# EAGLE design xpower_B (EAGLE 7.7.0)

## Sheet 1 of 2
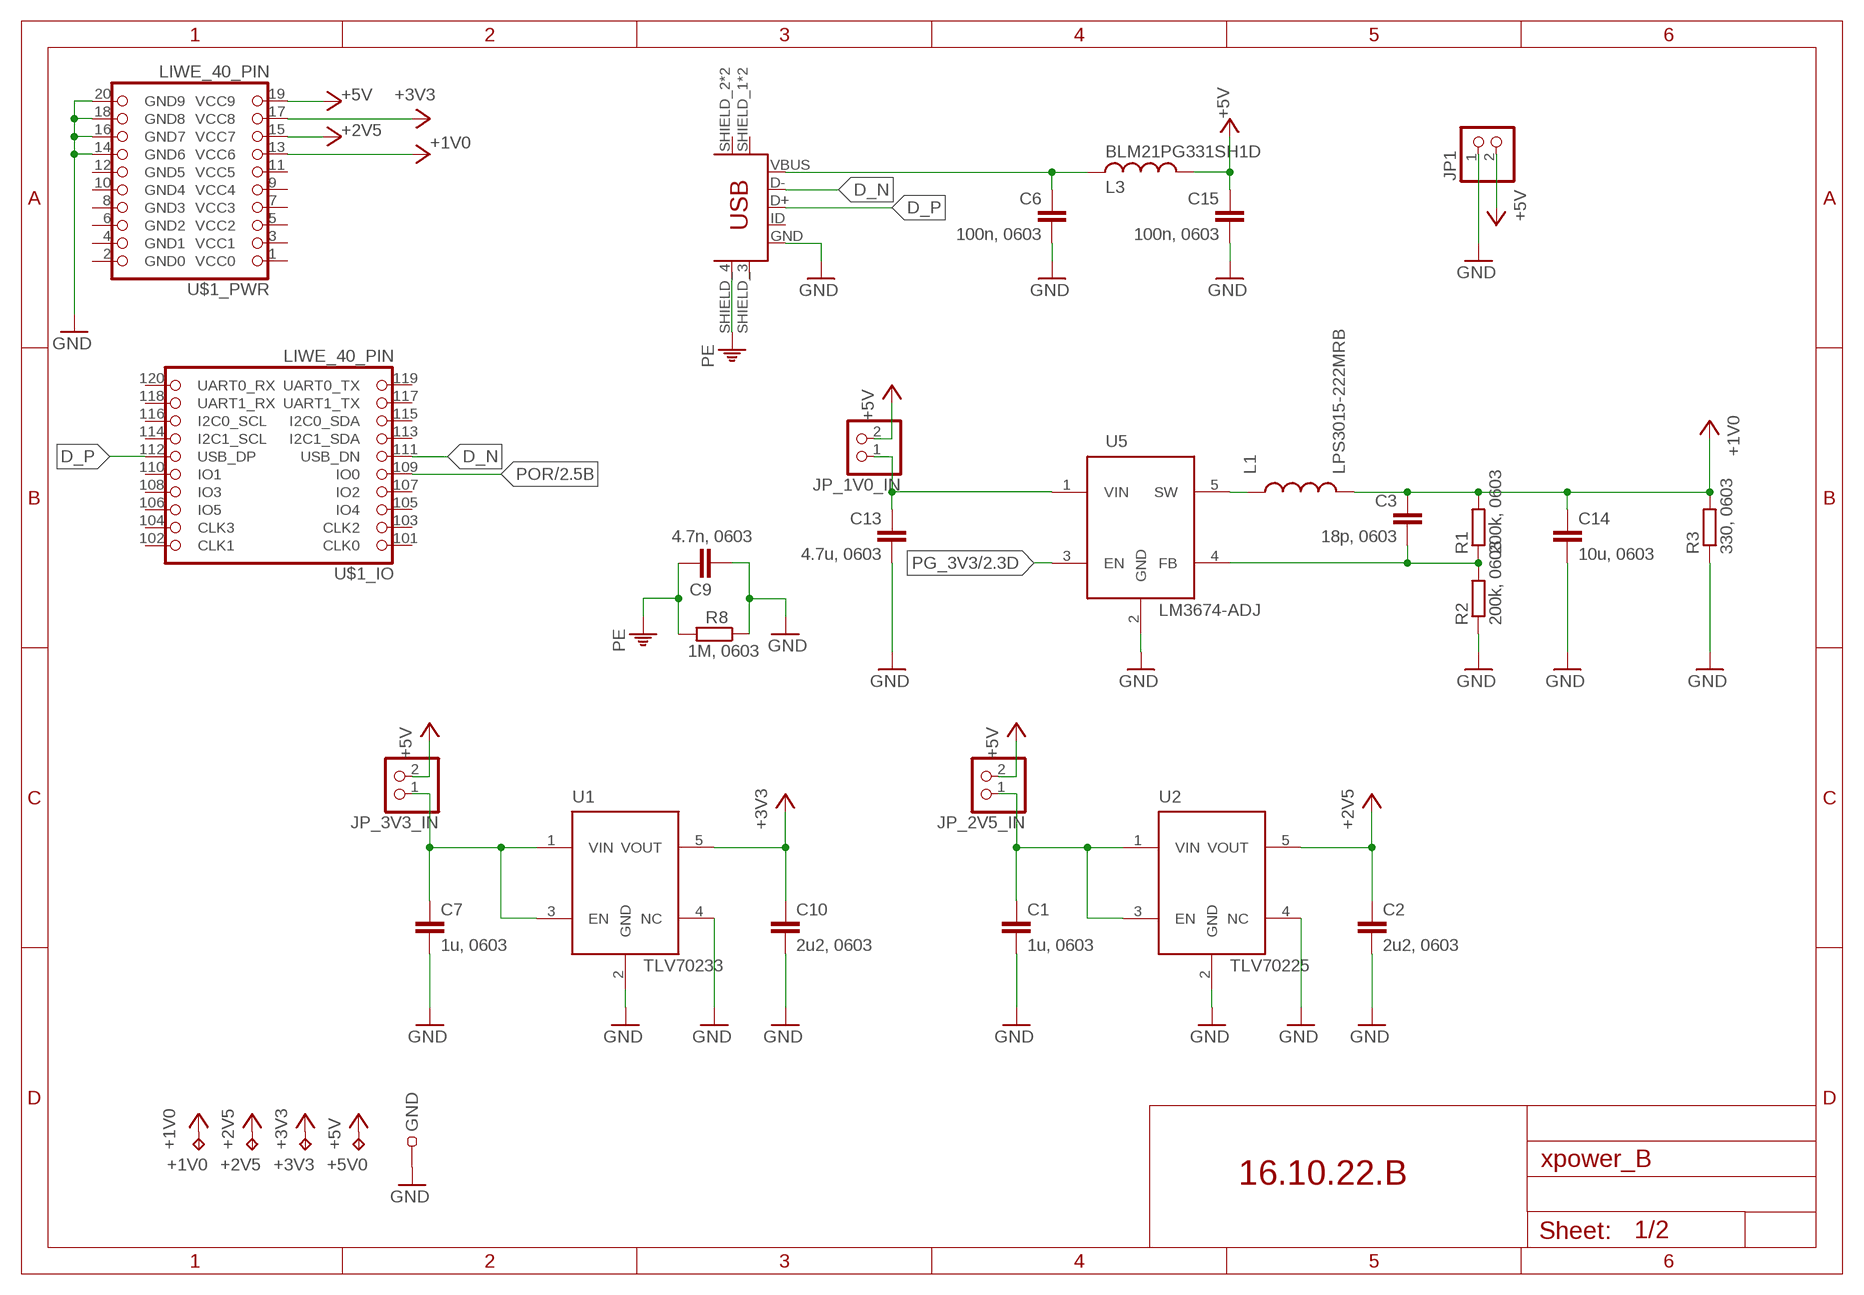
[diagram p0: schematic, sheet 1]

### Parts
+1V0  TPTP14R  [TP14R]
+2V5  TPTP14R  [TP14R]
+3V3  TPTP14R  [TP14R]
+5V0  TPTP14R  [TP14R]
C1  1u, 0603  C-EUC0603  [C0603]
C2  2u2, 0603  C-EUC0603  [C0603]
C3  18p, 0603  C-EUC0603  [C0603]
C6  100n, 0603  C-EUC0603  [C0603]
C7  1u, 0603  C-EUC0603  [C0603]
C9  4.7n, 0603  C-EUC0603  [C0603]
C10  2u2, 0603  C-EUC0603  [C0603]
C13  4.7u, 0603  C-EUC0603  [C0603]
C14  10u, 0603  C-EUC0603  [C0603]
C15  100n, 0603  C-EUC0603  [C0603]
GND  TEST-22-MULTICOMP  [TEST_1MM]
JP1  PINHD-1X2  [1X02]
JP_1V0_IN  PINHD-1X2  [1X02]
JP_2V5_IN  PINHD-1X2  [1X02]
JP_3V3_IN  PINHD-1X2  [1X02]
L1  LPS3015-222MRB  LPS3015  [LPS3015]
L3  BLM21PG331SH1D  L-USL0805  [R0805]
R1  200k, 0603  R-EU_R0603  [R0603]
R2  200k, 0603  R-EU_R0603  [R0603]
R3  330, 0603  R-EU_R0603  [R0603]
R8  1M, 0603  R-EU_R0603  [R0603]
U1  TLV70233  TLV702  [SOT-23-5]
U2  TLV70225  TLV702  [SOT-23-5]
U5  LM3674-ADJ  [SOT-23-5]
U$1  LIWE_40_PIN  [LIWE_40_PIN_8X8]
U$5  ZX62D-B-5PA8  [ZX62D-B-5PA8]

### Nets
+1V0: +1V0.TP C3.1 C14.1 L1.P2 R1.2 R3.2 U$1.13(_PWR:VCC6) ; also sheet 2
+2V5: +2V5.TP C2.1 U2.5(VOUT) U$1.15(_PWR:VCC7)
+3V3: +3V3.TP C10.1 U1.5(VOUT) U$1.17(_PWR:VCC8) ; also sheet 2
+5V: +5V0.TP C15.1 JP1.2 JP_1V0_IN.2 JP_2V5_IN.2 JP_3V3_IN.2 L3.1 U$1.19(_PWR:VCC9)
D_N: U$1.111(_IO:USB_DN) U$5.D-
D_P: U$1.112(_IO:USB_DP) U$5.D+
FB: C3.2 R1.1 R2.2 U5.4(FB)
GND: C1.2 C2.2 C6.2 C7.2 C9.2 C10.2 C13.2 C14.2 C15.2 GND.1 JP1.1 R2.1 R3.1 R8.1 U1.2(GND) U1.4(NC) U2.2(GND) U2.4(NC) U5.2(GND) U$1.14(_PWR:GND6) U$1.16(_PWR:GND7) U$1.18(_PWR:GND8) U$1.20(_PWR:GND9) U$5.GND ; also sheet 2
L: L1.P1 U5.5(SW)
N$1: C1.1 JP_2V5_IN.1 U2.1(VIN) U2.3(EN)
N$2: C7.1 JP_3V3_IN.1 U1.1(VIN) U1.3(EN)
N$3: C13.1 JP_1V0_IN.1 U5.1(VIN)
PE: C9.1 R8.2 U$5.SHIELD_4(MTN4)
PG_3V3: U5.3(EN) ; also sheet 2
POR: U$1.109(_IO:IO0) ; also sheet 2
VBUS: C6.1 L3.2 U$5.VBUS
Unconnected: U$1.1(_PWR:VCC0) U$1.2(_PWR:GND0) U$1.3(_PWR:VCC1) U$1.4(_PWR:GND1) U$1.5(_PWR:VCC2) U$1.6(_PWR:GND2) U$1.7(_PWR:VCC3) U$1.8(_PWR:GND3) U$1.9(_PWR:VCC4) U$1.10(_PWR:GND4) U$1.11(_PWR:VCC5) U$1.12(_PWR:GND5) U$1.101(_IO:CLK0) U$1.102(_IO:CLK1) U$1.103(_IO:CLK2) U$1.104(_IO:CLK3) U$1.105(_IO:IO4) U$1.106(_IO:IO5) U$1.107(_IO:IO2) U$1.108(_IO:IO3) U$1.110(_IO:IO1) U$1.113(_IO:I2C1_SDA) U$1.114(_IO:I2C1_SCL) U$1.115(_IO:I2C0_SDA) U$1.116(_IO:I2C0_SCL) U$1.117(_IO:UART1_TX) U$1.118(_IO:UART1_RX) U$1.119(_IO:UART0_TX) U$1.120(_IO:UART0_RX) U$5.ID U$5.SHIELD_1(MTN1) U$5.SHIELD_2(MTN2) U$5.SHIELD_3(MTN3) U$5.SHIELD_A(MTN1) U$5.SHIELD_B(MTN2)

### Notes on the sheet
- 16.10.22.B

## Sheet 2 of 2
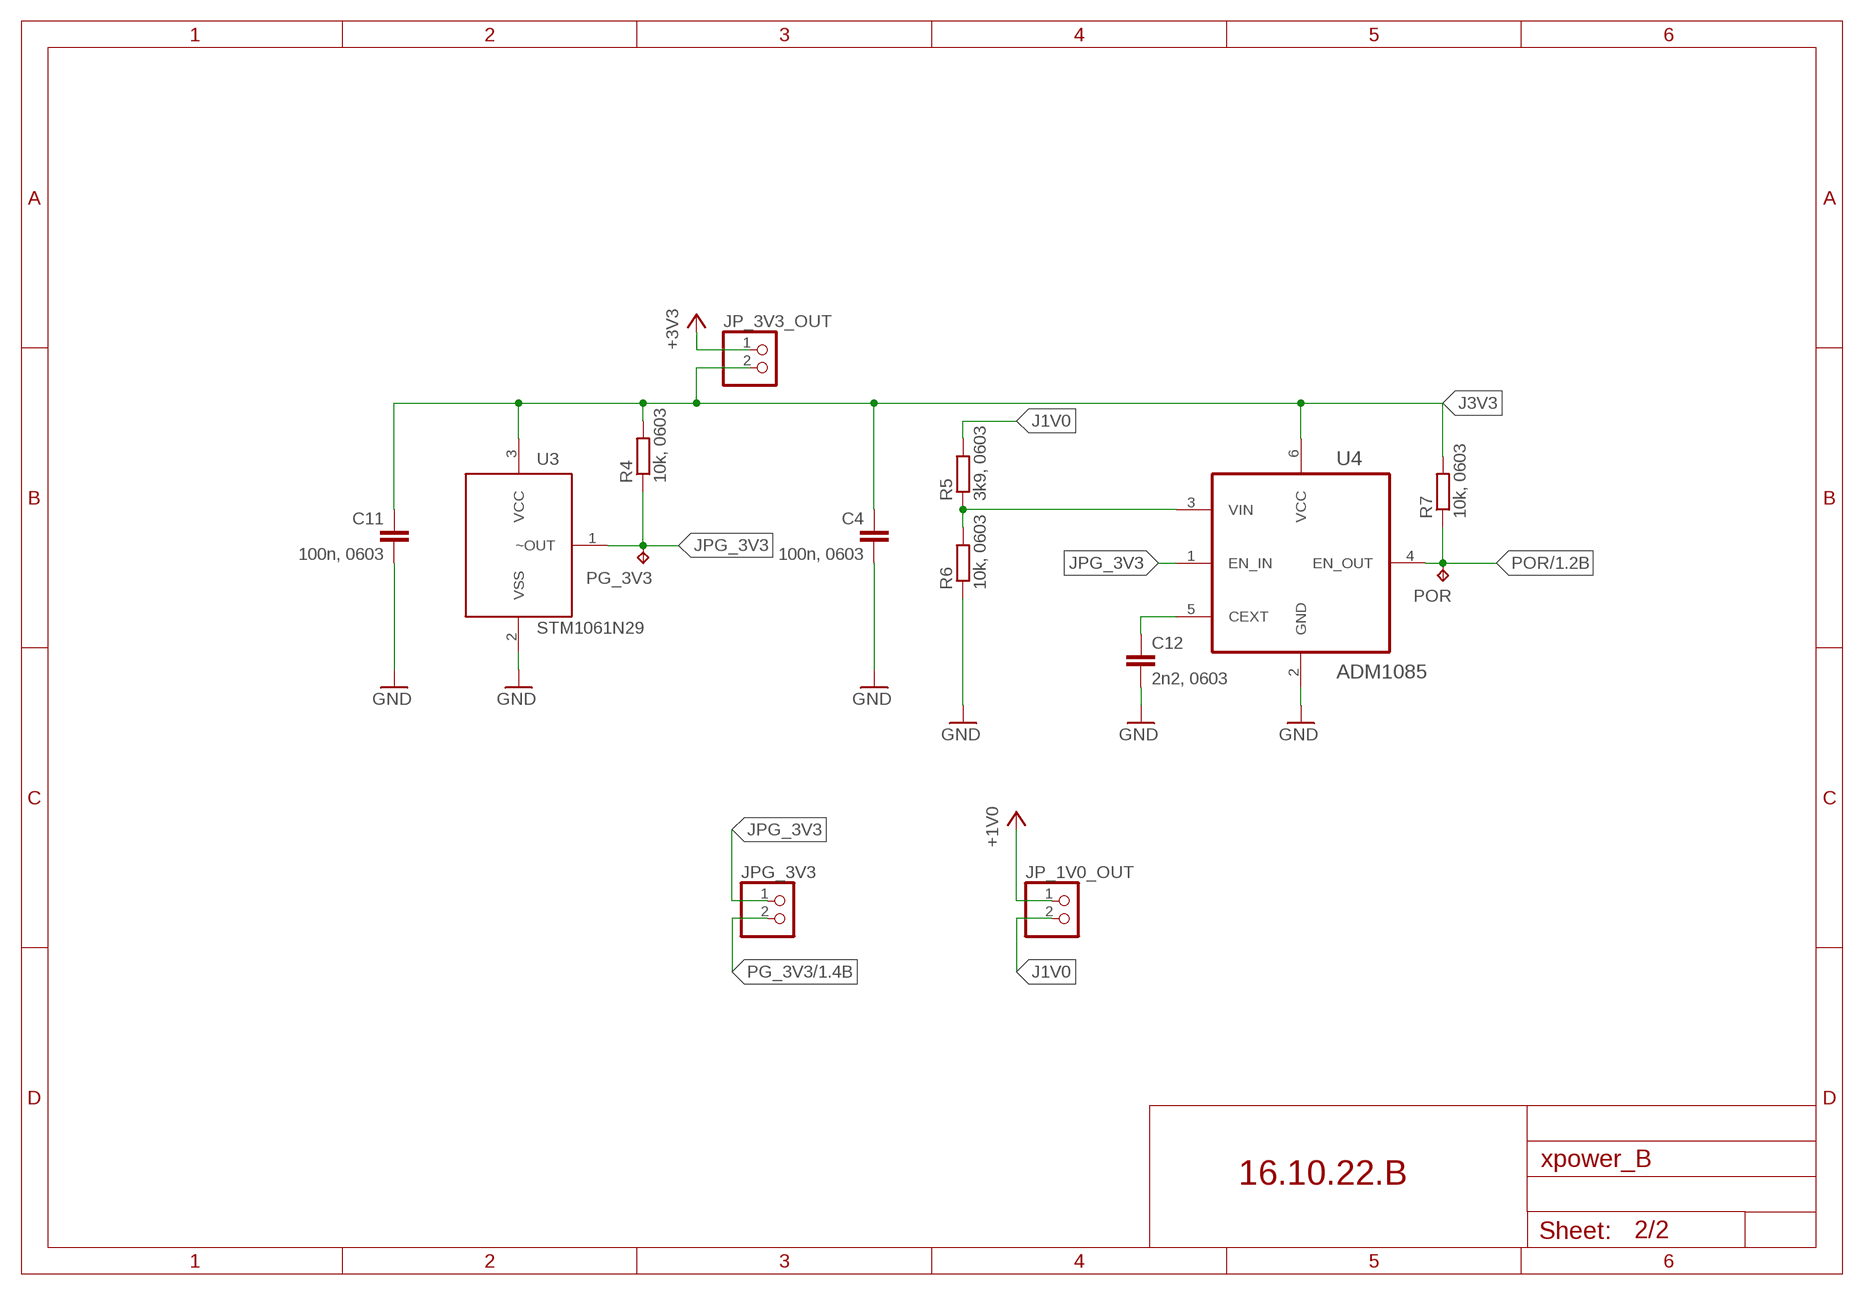
[diagram p1: schematic, sheet 2]

### Parts
C4  100n, 0603  C-EUC0603  [C0603]
C11  100n, 0603  C-EUC0603  [C0603]
C12  2n2, 0603  C-EUC0603  [C0603]
JP_1V0_OUT  PINHD-1X2  [1X02]
JP_3V3_OUT  PINHD-1X2  [1X02]
JPG_3V3  PINHD-1X2  [1X02]
PG_3V3  TPTP14R  [TP14R]
POR  TPTP14R  [TP14R]
R4  10k, 0603  R-EU_R0603  [R0603]
R5  3k9, 0603  R-EU_R0603  [R0603]
R6  10k, 0603  R-EU_R0603  [R0603]
R7  10k, 0603  R-EU_R0603  [R0603]
U3  STM1061N29  STM1061  [SOT-23-3]
U4  ADM1085  [SOT65P210X110-6N]

### Nets
+1V0: JP_1V0_OUT.1 ; also sheet 1
+3V3: JP_3V3_OUT.1 ; also sheet 1
CEXT: C12.1 U4.5(CEXT)
GND: C4.2 C11.2 C12.2 R6.1 U3.2(VSS) U4.2(GND) ; also sheet 1
J1V0: JP_1V0_OUT.2 R5.2
J3V3: C4.1 C11.1 JP_3V3_OUT.2 R4.2 R7.2 U3.3(VCC) U4.6(VCC)
JPG_3V3: JPG_3V3.1 PG_3V3.TP R4.1 U3.1(~OUT) U4.1(EN_IN)
PG_3V3: JPG_3V3.2 ; also sheet 1
POR: POR.TP R7.1 U4.4(EN_OUT) ; also sheet 1
VIN: R5.1 R6.2 U4.3(VIN)

### Notes on the sheet
- 16.10.22.B

## Library data of the parts
+1V0 +2V5 +3V3 +5V0 PG_3V3 POR = testpad:TP: Test pad
C1-C4 C6 C7 C9-C15 = rcl:C-EU: CAPACITOR, European symbol
GND = 25cmsquare:TEST-22-MULTICOMP: MULTICOMP TEST-22 TEST PIN, PCB, 1.0MM FARNELL: 1702010
JP1 JP_1V0_IN JP_2V5_IN JP_3V3_IN = pinhead:PINHD-1X2: PIN HEADER
JP_1V0_OUT JP_3V3_OUT JPG_3V3 = 25pinhead:PINHD-1X2: PIN HEADER
L1 = inductor-coilcraft:LPS3015
L3 = resistor:L-US: INDUCTOR, American symbol
R1-R8 = rcl:R-EU_: RESISTOR, European symbol
U1 U2 = 25cmsquare:TLV702
U3 = 25cmsquare:STM1061
U4 = 25cmsquare:ADM1085: Simple Sequencers® in 6-Lead SC70; MPN: ADM1085AKSZ-REEL7; OC_FARNELL: 1838906; OC_NEWARK: 59K1876; PACKAGE: SOT-23-6; SUPPLIER: Analog Devices
U5 = 25cmsquare:LM3674-ADJ
U$1 = 25cmsquare:LIWE_40_PIN
U$5 = pma:ZX62D-B-5PA8

## Board
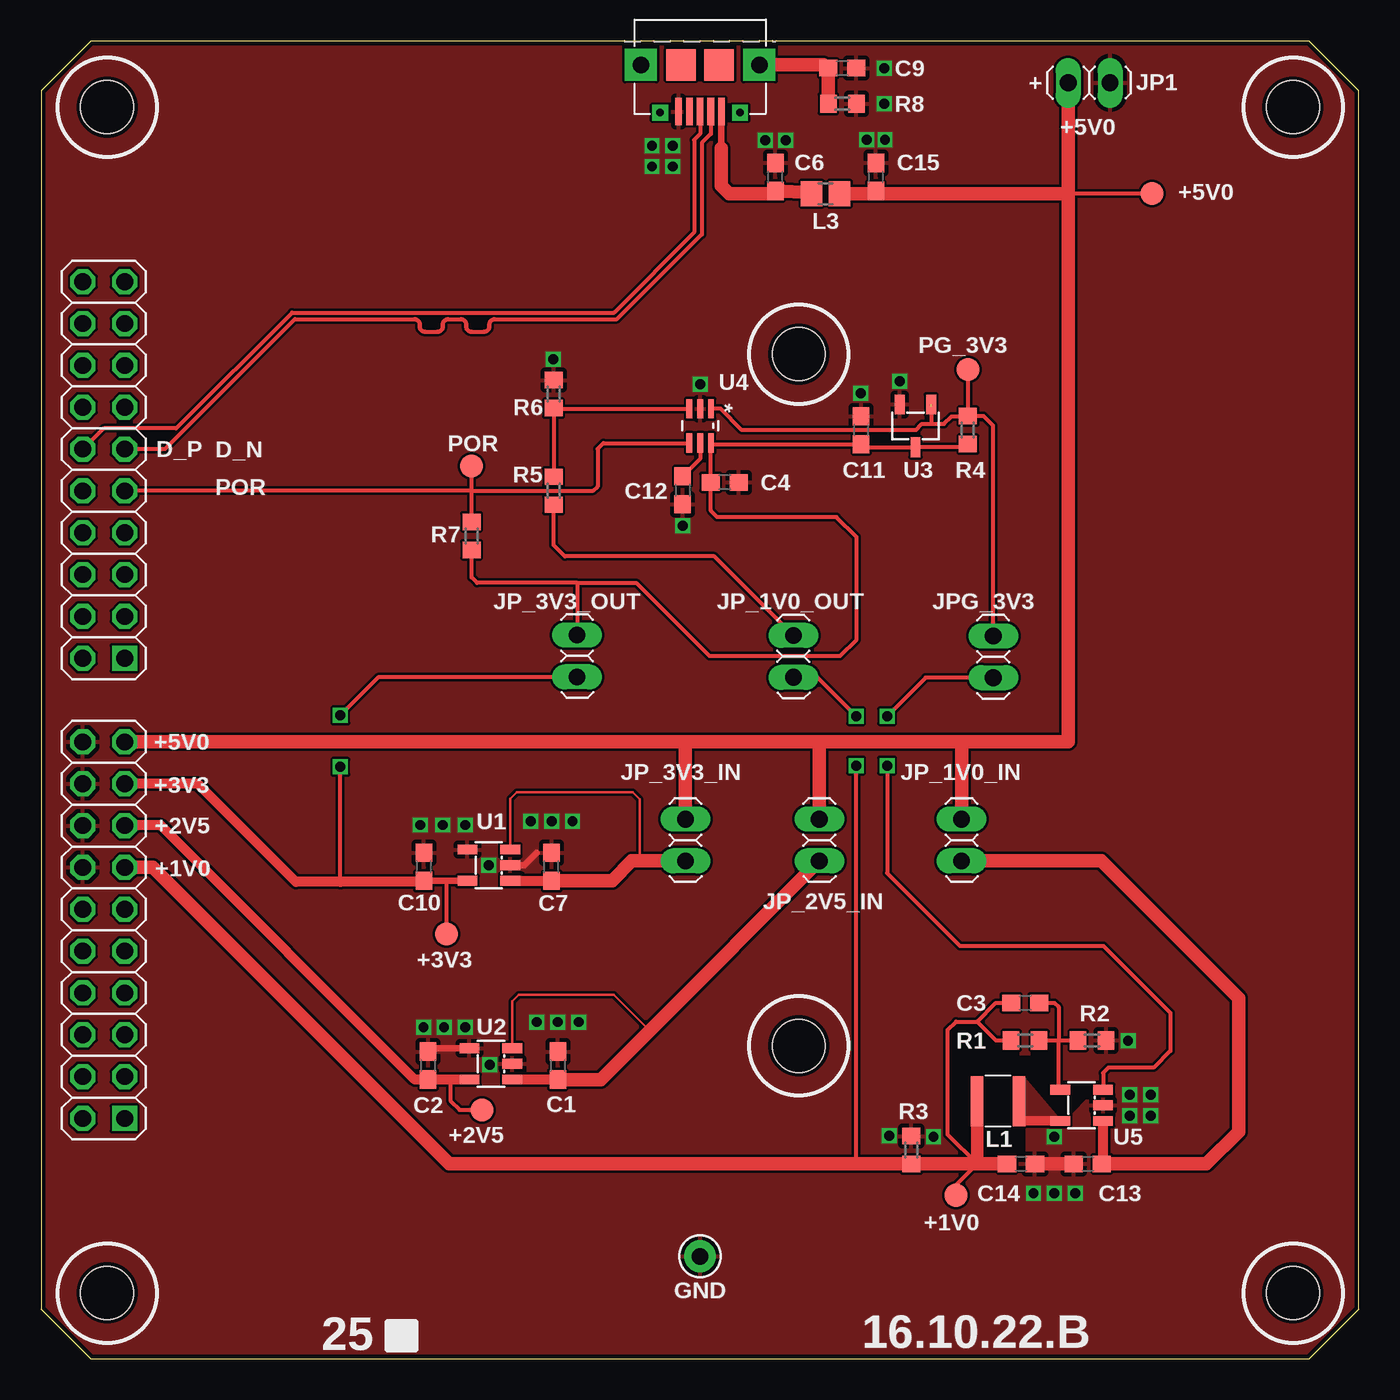
[diagram p2: board, top side]
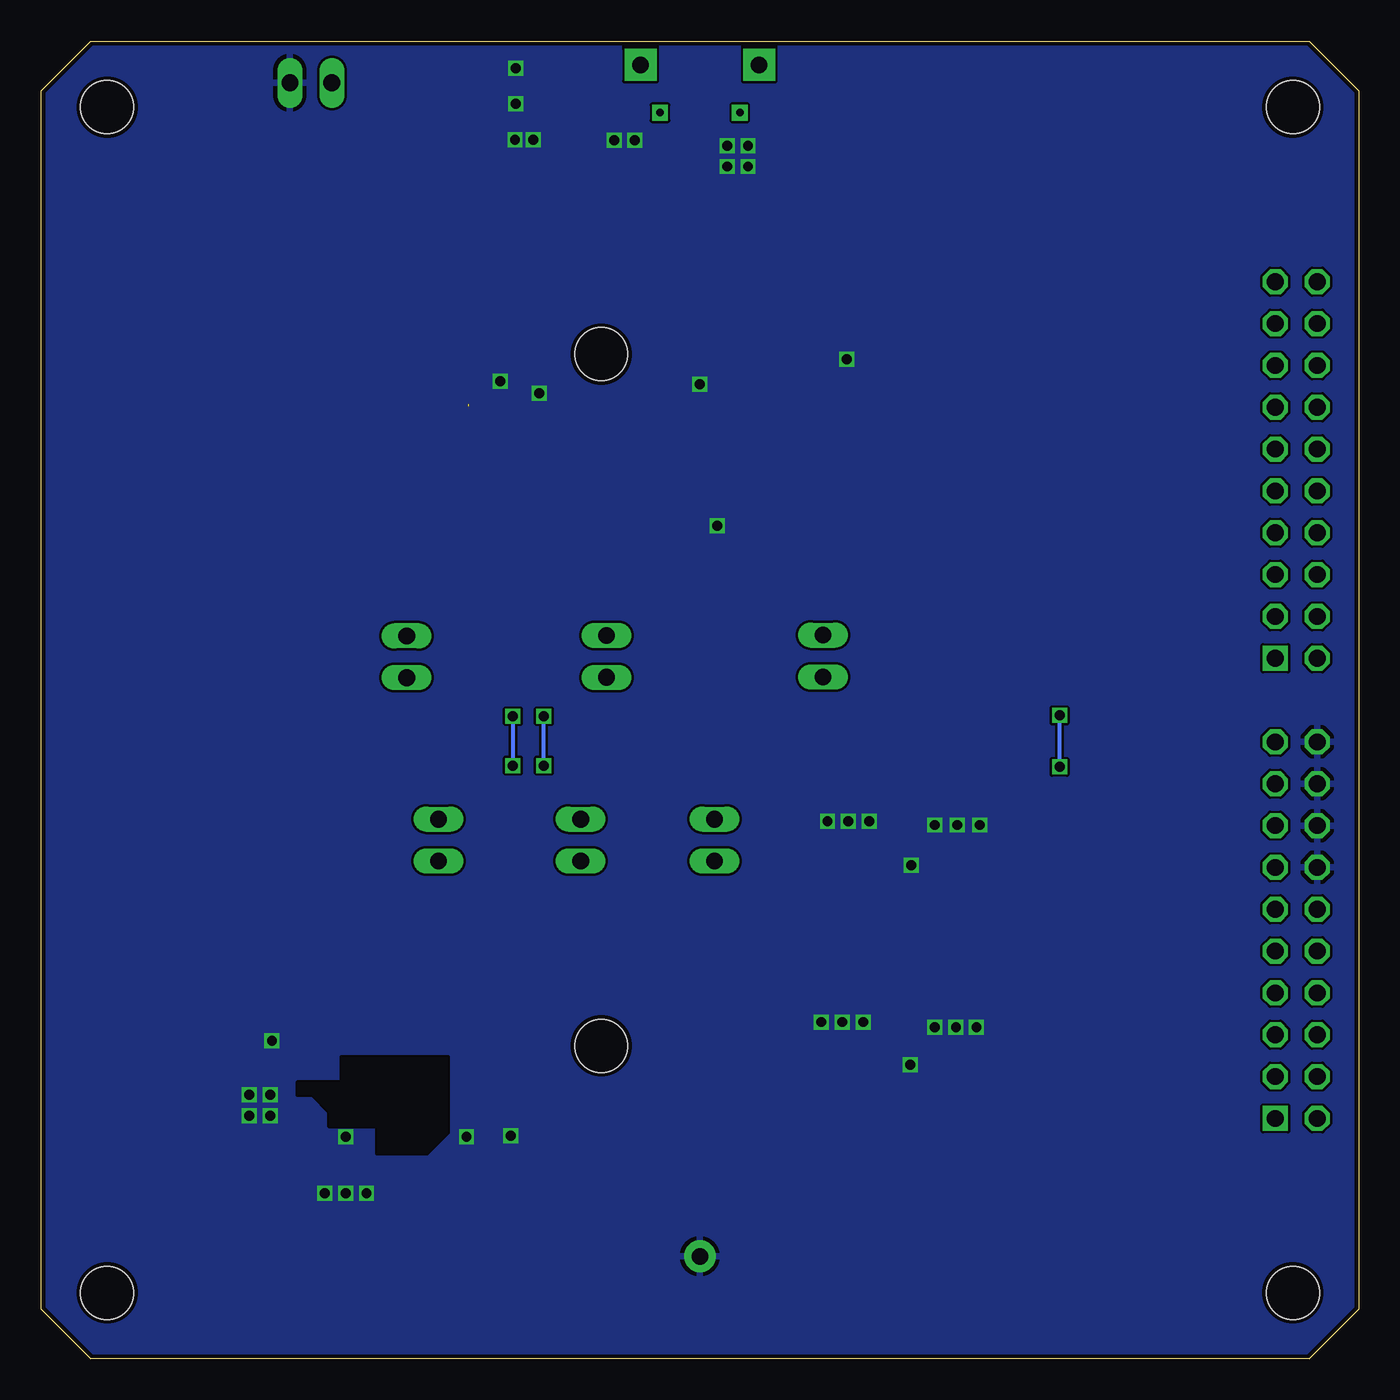
[diagram p3: board, bottom side, seen from below]

Size 80 x 80 mm. Coordinates in mm from the lower left corner, seen from the top.
Copper layers (1*16): Top 0.035mm / dielectric 1.5mm / Bottom 0.035mm
Design rules "SeeedStudio_2layer_DRU_no_angle_20140221": minimum track width 6mil, minimum drill 12mil, track to track 6mil, track to pad 6mil, pad to pad 6mil, via to via 6mil, smd to smd 0mil, copper to edge 10mil, drill to drill 10mil, minimum pad ring 10mil, minimum via ring 6mil, stop-mask expansion 2mil, vias tented up to drill 100mil, thermal gap 10mil
tRestrict: area 55.2,12.7 to 64.4,18.3
bRestrict: area 55.3,12.5 to 64.4,18.3

### Footprints (pad centres in the part's own frame; a part is rotated, then mirrored left to right if it is on the bottom)
TP14R = smd 1.4 x 1.4: TP 0,0
C0603 = smd 1.1 x 1: 1 -0.85,0; 2 0.85,0
TEST_1MM = drill 1 pad 1.93: 1 0,0
1X02 = drill 1.016 long: 1 -1.27,0; 2 1.27,0
LPS3015 = smd 0.762 x 3.048: P1 0.381,1.524; P2 2.921,1.524
R0805 = smd 1.3 x 1.5: 1 -0.85,0; 2 0.85,0
R0603 = smd 1 x 1.1: 1 -0.85,0; 2 0.85,0
SOT-23-5 = smd 0.6 x 1.2: 1 -0.95,-1.3; 2 0,-1.3; 3 0.95,-1.3; 4 0.95,1.3; 5 -0.95,1.3
SOT-23-3 = smd 0.6 x 1.2: 1 -0.95,-1.3; 2 0.95,-1.3; 3 0,1.3
SOT65P210X110-6N = smd 1.168 x 0.356: 1 -1.041,0.66; 2 -1.041,0; 3 -1.041,-0.66; 4 1.041,-0.66; 5 1.041,0; 6 1.041,0.66
LIWE_40_PIN_8X8 = drill 1.016 square: 1 74.93,65.405; 101 74.93,37.465 | drill 1.016 octagon: 2 77.47,65.405; 3 74.93,62.865; 4 77.47,62.865; 5 74.93,60.325; 6 77.47,60.325; 7 74.93,57.785; 8 77.47,57.785; 9 74.93,55.245; 10 77.47,55.245; 11 74.93,52.705; 12 77.47,52.705; 13 74.93,50.165; 14 77.47,50.165; 15 74.93,47.625; 16 77.47,47.625; 17 74.93,45.085; 18 77.47,45.085; 19 74.93,42.545; 20 77.47,42.545; 102 77.47,37.465; 103 74.93,34.925; 104 77.47,34.925; 105 74.93,32.385; 106 77.47,32.385; 107 74.93,29.845; 108 77.47,29.845; 109 74.93,27.305; 110 77.47,27.305; 111 74.93,24.765; 112 77.47,24.765; 113 74.93,22.225; 114 77.47,22.225; 115 74.93,19.685; 116 77.47,19.685; 117 74.93,17.145; 118 77.47,17.145; 119 74.93,14.605; 120 77.47,14.605 | hole 3.2: 34,19; 34,61; 4,76; 4,4; 76,4; 76,76
ZX62D-B-5PA8 = smd 0.4 x 1.65 bottom: D+ 0,4.285; D- 0.65,4.285; GND -1.3,4.285; ID -0.65,4.285; VBUS 1.3,4.285 | drill 0.45 pad 0.813 square: SHIELD_1 -2.425,4.35; SHIELD_2 2.425,4.35 | drill 1 pad 1.93 square: SHIELD_3 -3.6,1.45; SHIELD_4 3.6,1.45 | smd 1.8 x 1.9 bottom: SHIELD_A -1.15,1.45; SHIELD_B 1.15,1.45

### Placement (x,y rotation side)
+1V0  55.55,9.93 0 top
+2V5  26.77,15.11 0 top
+3V3  24.61,25.81 0 top
+5V0  67.44,70.74 0 top
C1  31.37,17.81 90 top
C2  23.5,17.81 90 top
C3  59.74,21.62 0 top
C4  41.5,53.21 0 top
C6  44.58,71.75 90 top
C7  30.99,29.87 90 top
C9  48.64,78.36 0 top
C10  23.24,29.87 90 top
C11  49.78,56.39 90 top
C12  38.94,52.73 270 top
C13  63.55,11.84 180 top
C14  59.49,11.84 0 top
C15  50.67,71.75 90 top
GND  40.01,6.22 0 top
JP1  63.63,77.47 180 top
JP_1V0_IN  55.88,31.5 90 top
JP_1V0_OUT  45.67,42.65 90 top
JP_2V5_IN  47.24,31.5 90 top
JP_3V3_IN  39.12,31.5 90 top
JP_3V3_OUT  32.54,42.67 90 top
JPG_3V3  57.81,42.62 270 top
L1  59.74,17.17 180 top
L3  47.62,70.74 180 top
PG_3V3  56.26,60.07 0 top
POR  26.14,54.2 0 top
R1  59.74,19.33 180 top
R2  63.8,19.33 180 top
R3  52.83,12.67 270 top
R4  56.26,56.39 270 top
R5  31.11,52.7 270 top
R6  31.11,58.57 270 top
R7  26.14,49.96 270 top
R8  48.64,76.2 180 top
U1  27.18,29.97 90 top
U2  27.3,17.91 90 top
U3  53.09,56.64 180 top
U4  40.01,56.64 270 top
U5  63.17,15.39 90 top
U$1  80,80 180 top
U$5  40.01,80.01 180 bottom

### Tracks (layer width: path | path; a pad name or v marks a point on that pad's centre or on a via)
+1V0  (via drill 0.6)
  Top 0.254: 56.82,20.47 55.55,20.47 55.04,19.96 55.04,13.61 56.82,11.84 55.55,10.57 +1V0.TP | 56.82,20.47 57.96,21.61 C3.1 | 56.82,20.47 57.96,19.33 R1.2 | 51.54,11.84 52.82,11.84 R3.2 | v49.48,36.02 49.48,11.84 49.58,11.84 | v49.48,39.01 47.12,41.38 JP_1V0_OUT.1
  Top 0.762: L1.P2 56.82,11.84
  Top 0.813: C14.1 56.82,11.84 51.54,11.84 49.58,11.84 24.79,11.84 6.78,29.84 U$1.13
  Bottom 0.254: v49.48,36.02 v49.48,39.01
+2V5
  Top 0.254: U2.5 24.84,16.96 24.84,15.67 25.4,15.11 +2V5.TP
  Top 0.61: U2.5 C2.1 22.69,16.95 7.26,32.38 U$1.15
+3V3  (via drill 0.6)
  Top 0.254: 23.18,29.08 C10.1 | +3V3.TP 24.61,29.02 | U1.5 18.23,29.02 arc90 18.16,28.96 v18.16,35.94 | v18.16,39.06 20.5,41.4 JP_3V3_OUT.1
  Top 0.406: C10.1 24.61,29.02 U1.5
  Top 0.61: 23.18,29.08 23.05,28.96 18.16,28.96 15.47,28.96 9.5,34.92 5.08,34.92 U$1.17
  Bottom 0.254: v18.16,35.94 v18.16,39.06
+5V
  Top 0.254: C15.1 51.18,70.81 51.18,70.74 | +5V0.TP 62.36,70.74
  Top 0.813: 62.36,70.74 62.36,37.47 55.85,37.47 | 55.85,37.47 47.27,37.47 | 47.27,37.47 39.09,37.47 | 39.09,37.47 5.08,37.47 U$1.19 | 62.36,70.74 51.18,70.74 | L3.1 50.61,70.74 C15.1 | JP1.2 62.36,70.74 | JP_3V3_IN.2 39.12,37.44 39.09,37.47 | JP_2V5_IN.2 47.24,37.44 47.27,37.47 | JP_1V0_IN.2 55.88,37.44 55.85,37.47
CEXT
  Top 0.254: U4.5 40.01,54.65 C12.1
D_N
  Top 0.254: U$5.D- 40.66,74.37 40.11,73.82 40.11,68.27 34.96,63.12 27.53,63.12 arc90 27.22,62.8 27.22,62.68 arc-90 26.9,62.36 26.12,62.36 arc-90 25.8,62.68 25.8,62.8 arc90 25.48,63.12 24.71,63.12 arc90 24.39,62.8 24.39,62.68 arc-90 24.07,62.36 23.29,62.36 arc-90 22.98,62.68 22.98,62.8 arc90 22.66,63.12 15.4,63.12 7.52,55.23 U$1.111
D_P
  Top 0.254: U$5.D+ 40.01,74.36 39.65,74.01 39.65,68.39 34.79,63.52 15.23,63.52 8.2,56.49 3.79,56.49 U$1.112
FB
  Top 0.254: R1.1 61.77,19.33 | 61.77,19.33 R2.2 | U5.4 61.77,16.44 61.77,19.33 | C3.2 61.52,21.61 61.77,21.36 61.77,19.33
GND  (via drill 0.6)
  Top 0.406: U1.2 29.34,29.97 30.1,30.73 | U2.4 23.62,18.86
  Top 0.813: C14.2 C13.2
  other vias: 67.36,16.03 66.09,14.76 66.09,16.03 30.1,20.45 31.37,20.45 32.64,20.45 67.36,14.76 65.99,19.3 31.09,60.68 38.35,72.39 37.08,72.39 38.35,73.66 37.08,73.66 45.21,73.99 43.97,73.99 51.23,74.02 50.11,74.02 23.01,32.41 24.38,32.41 25.76,32.41 38.96,50.57 40.01,59.18 49.76,58.62 52.13,59.36 29.72,32.64 30.99,32.64 32.26,32.64 23.22,20.14 24.46,20.14 25.76,20.14 60.25,10.06 61.52,10.06 62.79,10.06 51.49,13.54 54.18,13.49 61.52,13.49 51.18,78.36 51.18,76.2 27.23,17.86 27.18,29.97
  pour Bottom: -2.29,82.04 81.41,81.41 82.42,-1.91 -1.27,-1.27
  pour Top (rank 6): -4.95,85.47 -4.32,-3.05 84.71,-3.94 84.07,84.58
  pour Top (no thermals): 27.43,30.61 27.94,30.1 28.96,30.1 29.46,30.48 29.46,29.59 28.96,29.84 27.94,29.84 27.43,29.34
J1V0
  Top 0.254: JP_1V0_OUT.2 40.87,48.72 31.8,48.72 31.11,49.4 R5.2
J3V3
  Top 0.254: U4.6 40.69,55.63 | R4.2 56.16,55.34 U3.3 49.88,55.34 C11.1 40.73,55.54 U4.6 | U4.6 40.66,53.23 C4.1 40.65,51.5 41.05,51.1 48.28,51.1 49.51,49.89 49.51,43.66 48.51,42.67 40.56,42.67 36.12,47.12 32.54,47.12 | 32.54,47.12 JP_3V3_OUT.2 | 32.54,47.12 26.47,47.12 26.14,47.45 R7.2
JPG_3V3  (1 unrouted)
  Top 0.254: R4.1 57.22,57.24 57.78,56.67 57.78,43.92 JPG_3V3.1 | PG_3V3.TP R4.1 | U4.1 41.25,57.68 42.55,56.39 53.09,56.39 53.47,56.77 54.04,56.77 | 54.04,56.77 54.81,56.77 55.27,57.23 56.25,57.23 R4.1 | 54.04,57.85 54.04,57.84 54.04,56.77
L
  Top 0.406: 59.55,14.44 59.49,14.38 59.49,15.52 L1.P1
  Top 0.584: U5.5 59.55,14.44
  pour Top (no thermals): 59.61,17.04 61.65,14.63 62.28,14.63 62.28,14.5 59.36,14.5 59.36,17.04
N$1
  Top 0.152: 29.92,17.06 30.02,16.96 | U2.3 28.61,21.7 29.01,22.1 34.77,22.1 36.94,19.93
  Top 0.254: 28.57,18.86 28.57,19.02 28.6,19.02 28.61,19.02 U2.3
  Top 0.406: U2.3 28.57,18.86
  Top 0.61: C1.1 30.02,16.96 U2.1
  Top 0.813: C1.1 33.5,16.96 33.98,16.96 36.94,19.93 JP_2V5_IN.1
N$2
  Top 0.152: U1.3 28.48,33.99 28.88,34.39 35.92,34.39 36.35,33.96 36.35,30.3 36.42,30.23
  Top 0.254: U1.3 28.45,30.92
  Top 0.406: U1.3 28.45,30.95
  Top 0.61: U1.1 C7.1
  Top 0.813: 31.05,28.96 C7.1 31,29.03 34.67,29.03 35.87,30.23 36.42,30.23 JP_3V3_IN.1
N$3
  Top 0.61: C13.1 64.47,11.87 U5.1
  Top 0.813: JP_1V0_IN.1 64.36,30.23 72.69,21.89 72.69,13.79 70.74,11.84 C13.1
PE
  Top 0.813: U$5.SHIELD_4 47.49,78.56 C9.1 R8.2
PG_3V3  (via drill 0.6)
  Top 0.254: U5.3 64.47,17.36 64.79,17.68 67.54,17.68 68.56,18.69 68.56,21.01 64.49,25.07 55.78,25.07 51.36,29.49 v51.36,36.02 | JPG_3V3.2 53.7,41.35 v51.36,39.01
  Bottom 0.254: v51.36,39.01 v51.36,36.02
POR
  Top 0.254: 26.14,52.7 33.53,52.7 33.78,52.96 33.78,55.24 34.14,55.6 U4.4 | R7.1 26.14,52.7 | 26.14,52.7 U$1.109 arc90 U$1.109 | 26.14,52.7 POR.TP
VBUS
  Top 0.406: U$5.VBUS 41.3,73.5
  Top 0.813: 41.3,73.5 41.3,71.22 41.78,70.74 44.51,70.74 C6.1 46.71,70.81 L3.2
VIN
  Top 0.254: R6.2 R5.1 | R6.2 31.18,57.68 | U4.3 31.15,57.68 R6.2

### Text on the board
tNames: + | +5V0 | D_P | D_N | POR | +5V0 | +3V3 | +2V5 | +1V0 | 25 | 16.10.22.B